# EAGLE schematic Logic (EAGLE 7.5.0)
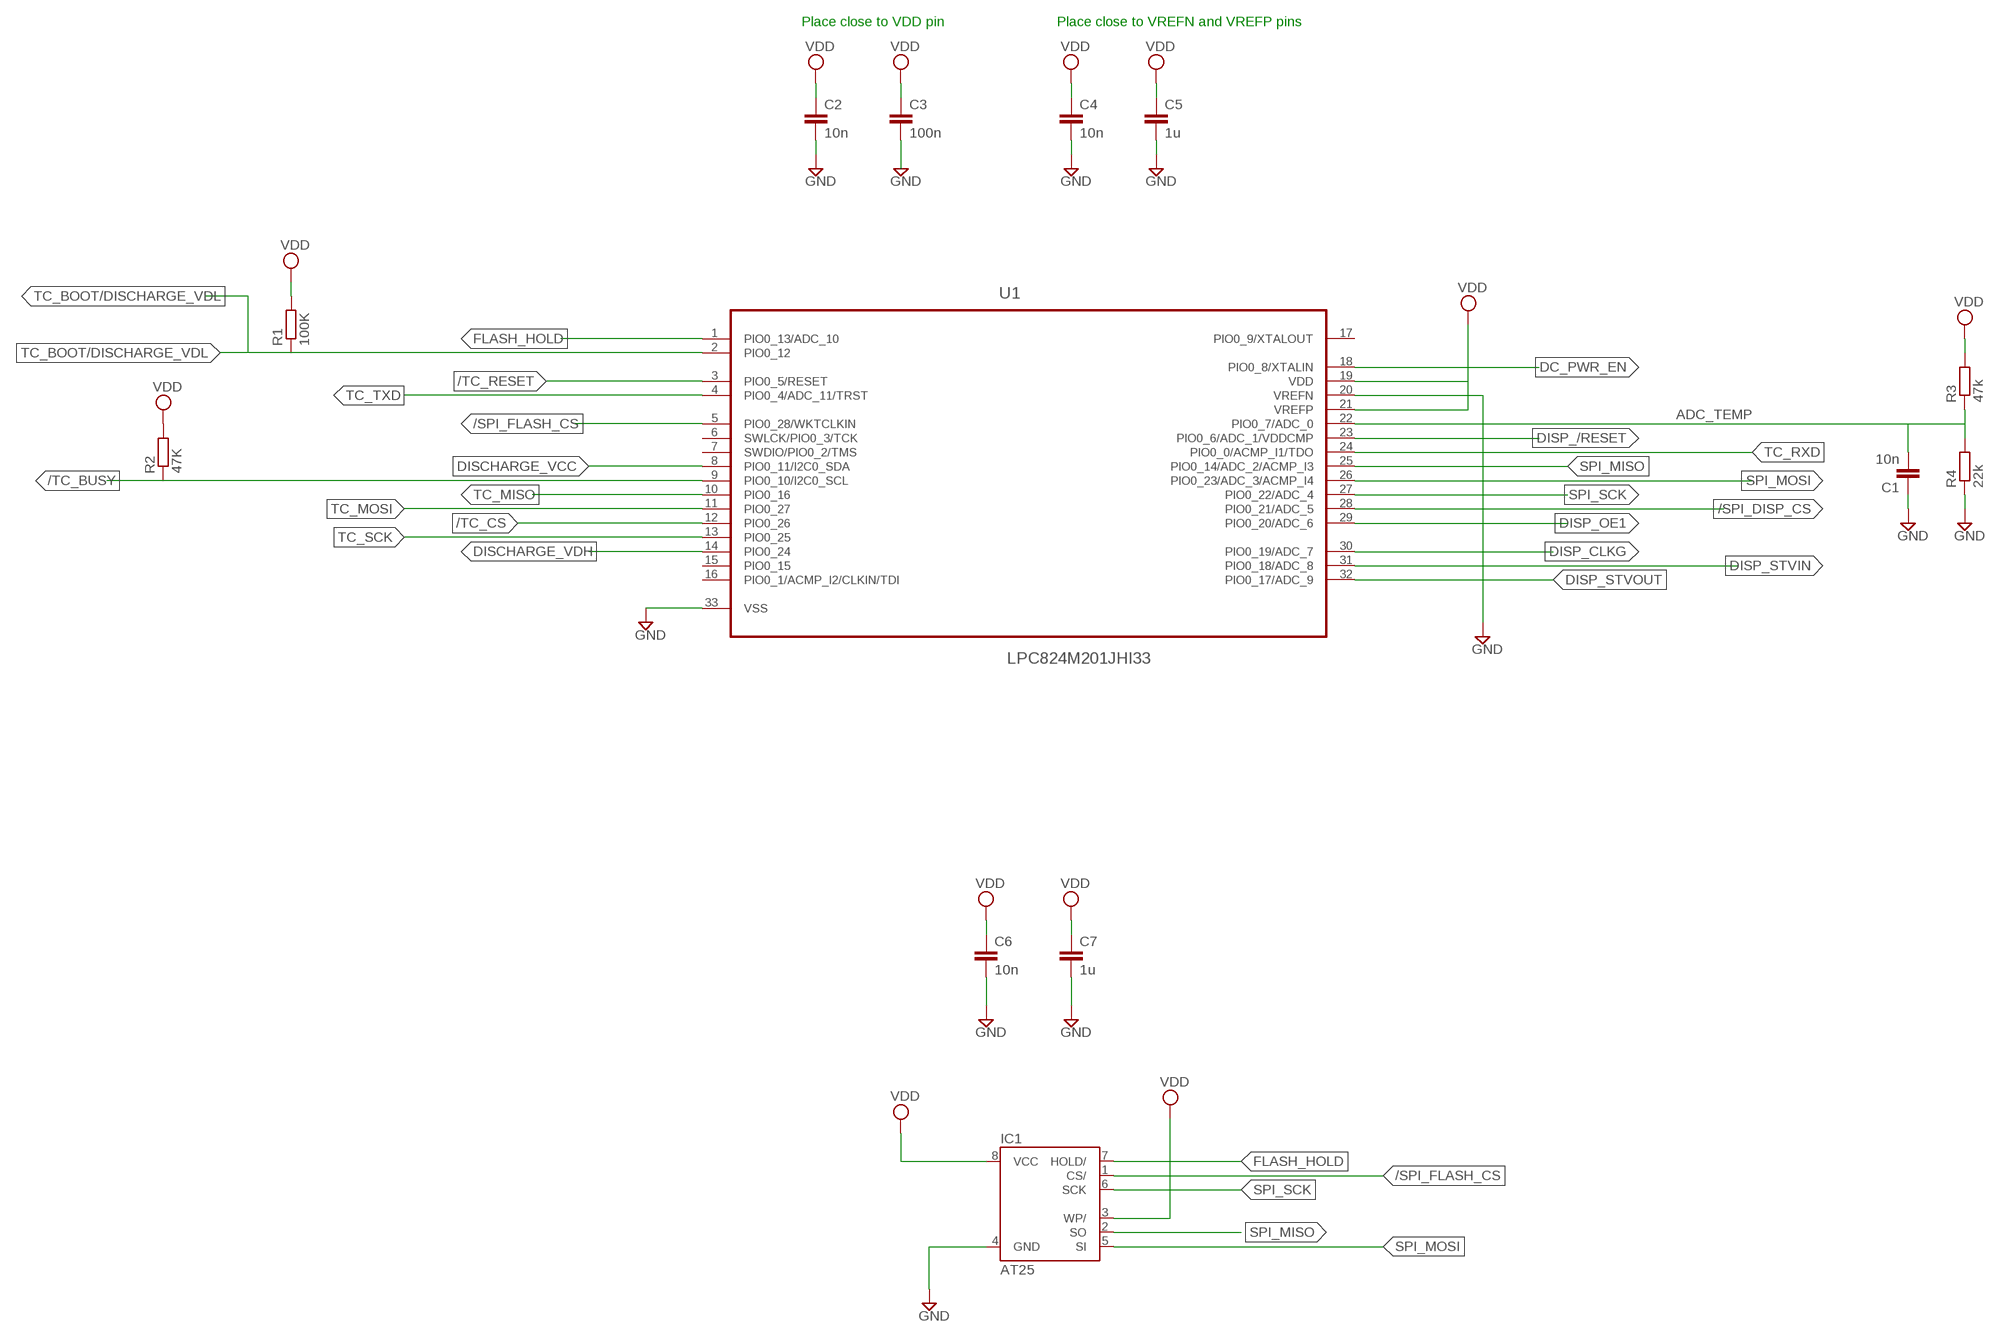
[diagram p0: schematic, sheet 1]

## Parts
C1  10n  C-EUC0603  [C0603]
C2  10n  C-EUC0603  [C0603]
C3  100n  C-EUC0603  [C0603]
C4  10n  C-EUC0603  [C0603]
C5  1u  C-EUC0603  [C0603]
C6  10n  C-EUC0603  [C0603]
C7  1u  C-EUC0603  [C0603]
IC1  AT25  [SOIC8]
R1  100K  R-EU_R0603  [R0603]
R2  47K  R-EU_R0603  [R0603]
R3  47k  R-EU_R0603  [R0603]
R4  22k  R-EU_R0603  [R0603]
U1  LPC824M201JHI33  [QFN65P700X700X100-33N]

## Nets
/SPI_DISP_CS: U1.28(PIO0_21/ADC_5)
/SPI_FLASH_CS: IC1.1(CS/) U1.5(PIO0_28/WKTCLKIN)
/TC_BUSY: R2.1 U1.9(PIO0_10/I2C0_SCL)
/TC_CS: U1.12(PIO0_26)
/TC_RESET: U1.3(PIO0_5/RESET)
ADC_TEMP: C1.2 R3.1 R4.2 U1.22(PIO0_7/ADC_0)
DC_PWR_EN: U1.18(PIO0_8/XTALIN)
DISCHARGE_VCC: U1.8(PIO0_11/I2C0_SDA)
DISCHARGE_VDH: U1.14(PIO0_24)
DISP_/RESET: U1.23(PIO0_6/ADC_1/VDDCMP)
DISP_CLKG: U1.30(PIO0_19/ADC_7)
DISP_OE1: U1.29(PIO0_20/ADC_6)
DISP_STVIN: U1.31(PIO0_18/ADC_8)
DISP_STVOUT: U1.32(PIO0_17/ADC_9)
FLASH_HOLD: IC1.7(HOLD/) U1.1(PIO0_13/ADC_10)
GND: C1.1 C2.2 C4.2 C5.2 C6.2 C7.2 IC1.4(GND) R4.1 U1.20(VREFN) U1.33(VSS)
N$1: C3.2
SPI_MISO: IC1.2(SO) U1.25(PIO0_14/ADC_2/ACMP_I3)
SPI_MOSI: IC1.5(SI) U1.26(PIO0_23/ADC_3/ACMP_I4)
SPI_SCK: IC1.6(SCK) U1.27(PIO0_22/ADC_4)
TC_BOOT/DISCHARGE_VDL: R1.1 U1.2(PIO0_12)
TC_MISO: U1.10(PIO0_16)
TC_MOSI: U1.11(PIO0_27)
TC_RXD: U1.24(PIO0_0/ACMP_I1/TDO)
TC_SCK: U1.13(PIO0_25)
TC_TXD: U1.4(PIO0_4/ADC_11/TRST)
VDD: C2.1 C3.1 C4.1 C5.1 C6.1 C7.1 IC1.3(WP/) IC1.8(VCC) R1.2 R2.2 R3.2 U1.19(VDD) U1.21(VREFP)
Unconnected: U1.6(SWLCK/PIO0_3/TCK) U1.7(SWDIO/PIO0_2/TMS) U1.15(PIO0_15) U1.16(PIO0_1/ACMP_I2/CLKIN/TDI) U1.17(PIO0_9/XTALOUT)

## Notes on the sheet
- Place close to VDD pin | Place close to VREFN and VREFP pins

## Library data of the parts
C1 = resistor:C-EU: CAPACITOR, European symbol
C2-C7 = rcl:C-EU: CAPACITOR, European symbol
IC1 = atmel:AT25*: SPI bus serial EEPROM
R1 R3 R4 = resistor:R-EU_: RESISTOR, European symbol
R2 = rcl:R-EU_: RESISTOR, European symbol
U1 = NXP_By_element14_Batch_1:LPC824M201JHI33: 32-bit ARM Cortex-M0 microcontroller up to 32 kB flash and 8 kB SRAM; MPN: LPC1114FHN33/201,5; OC_FARNELL: -; OC_NEWARK: 70R5584; PACKAGE: HVQFN-32; SUPPLIER: NXP